# EAGLE schematic smt_xbee (EAGLE 9.6.2)

## Sheet 1 of 2
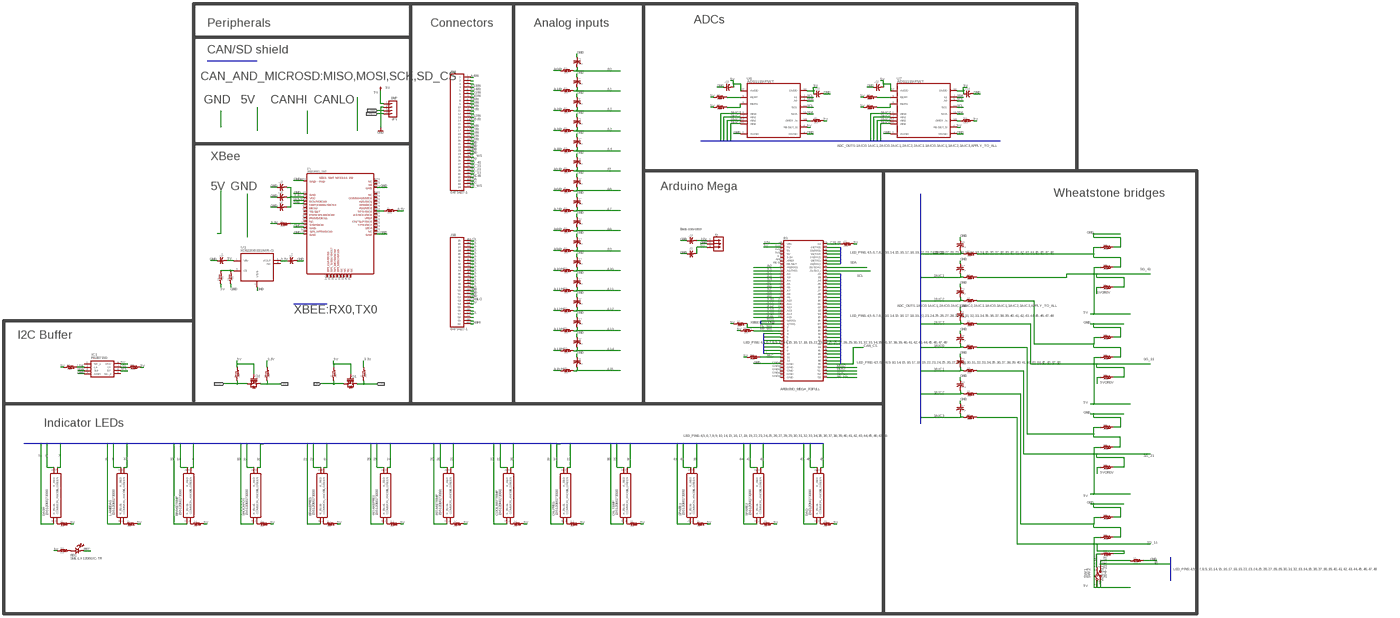
[diagram p0: schematic, sheet 1, overview]
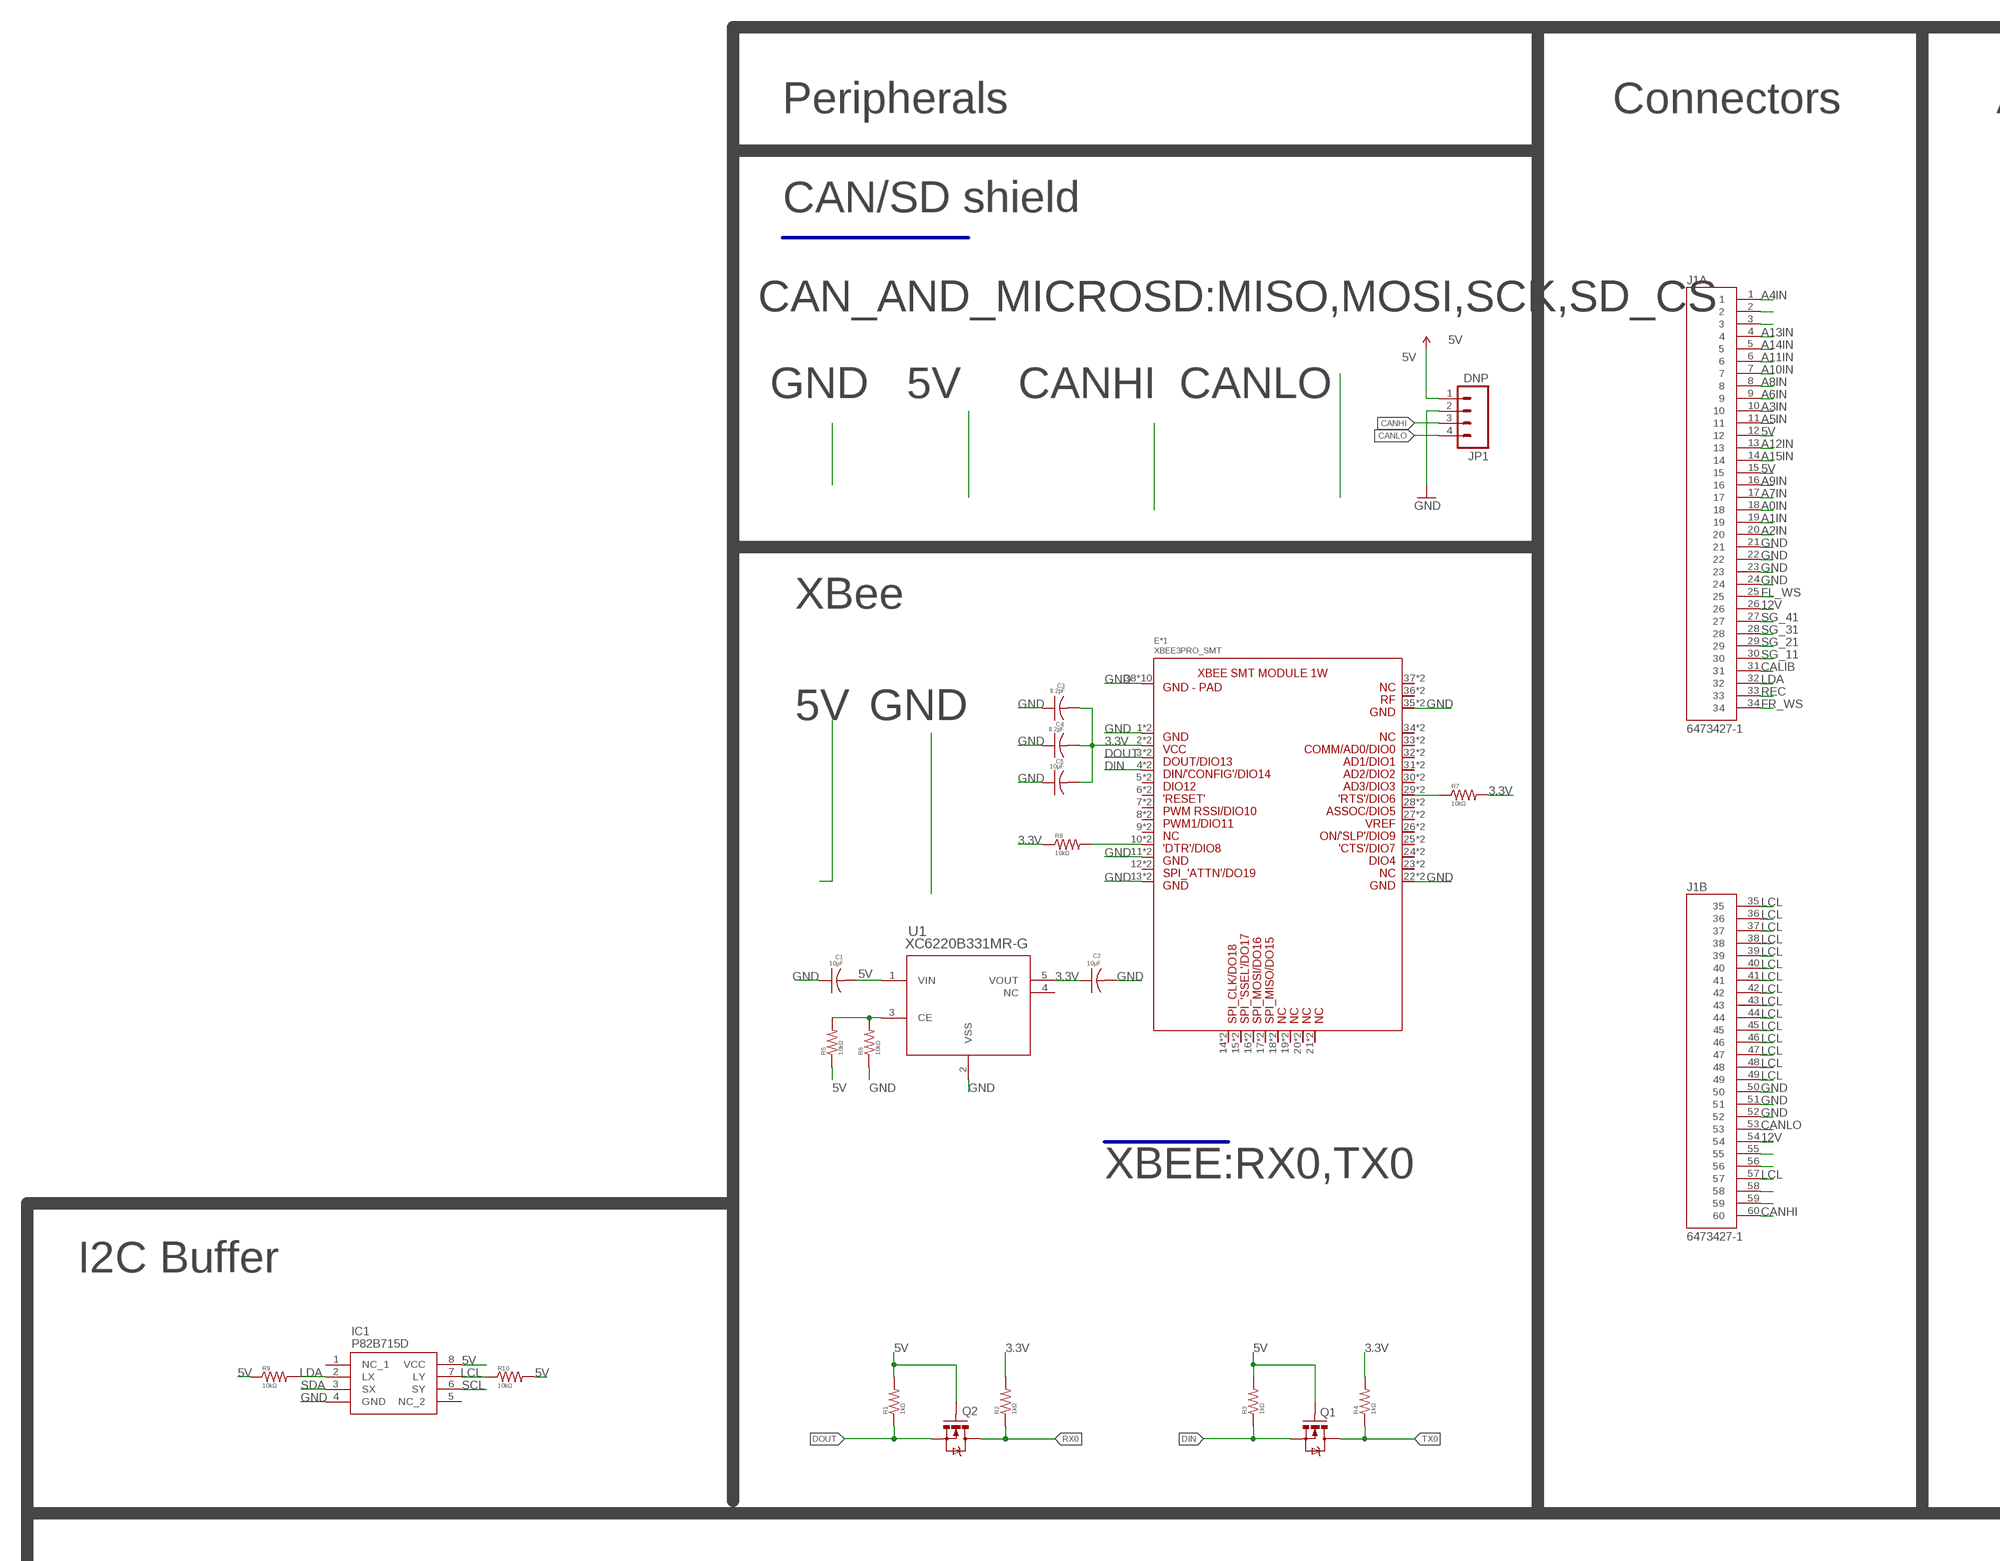
[diagram p1: schematic, sheet 1, part 1 of 5]
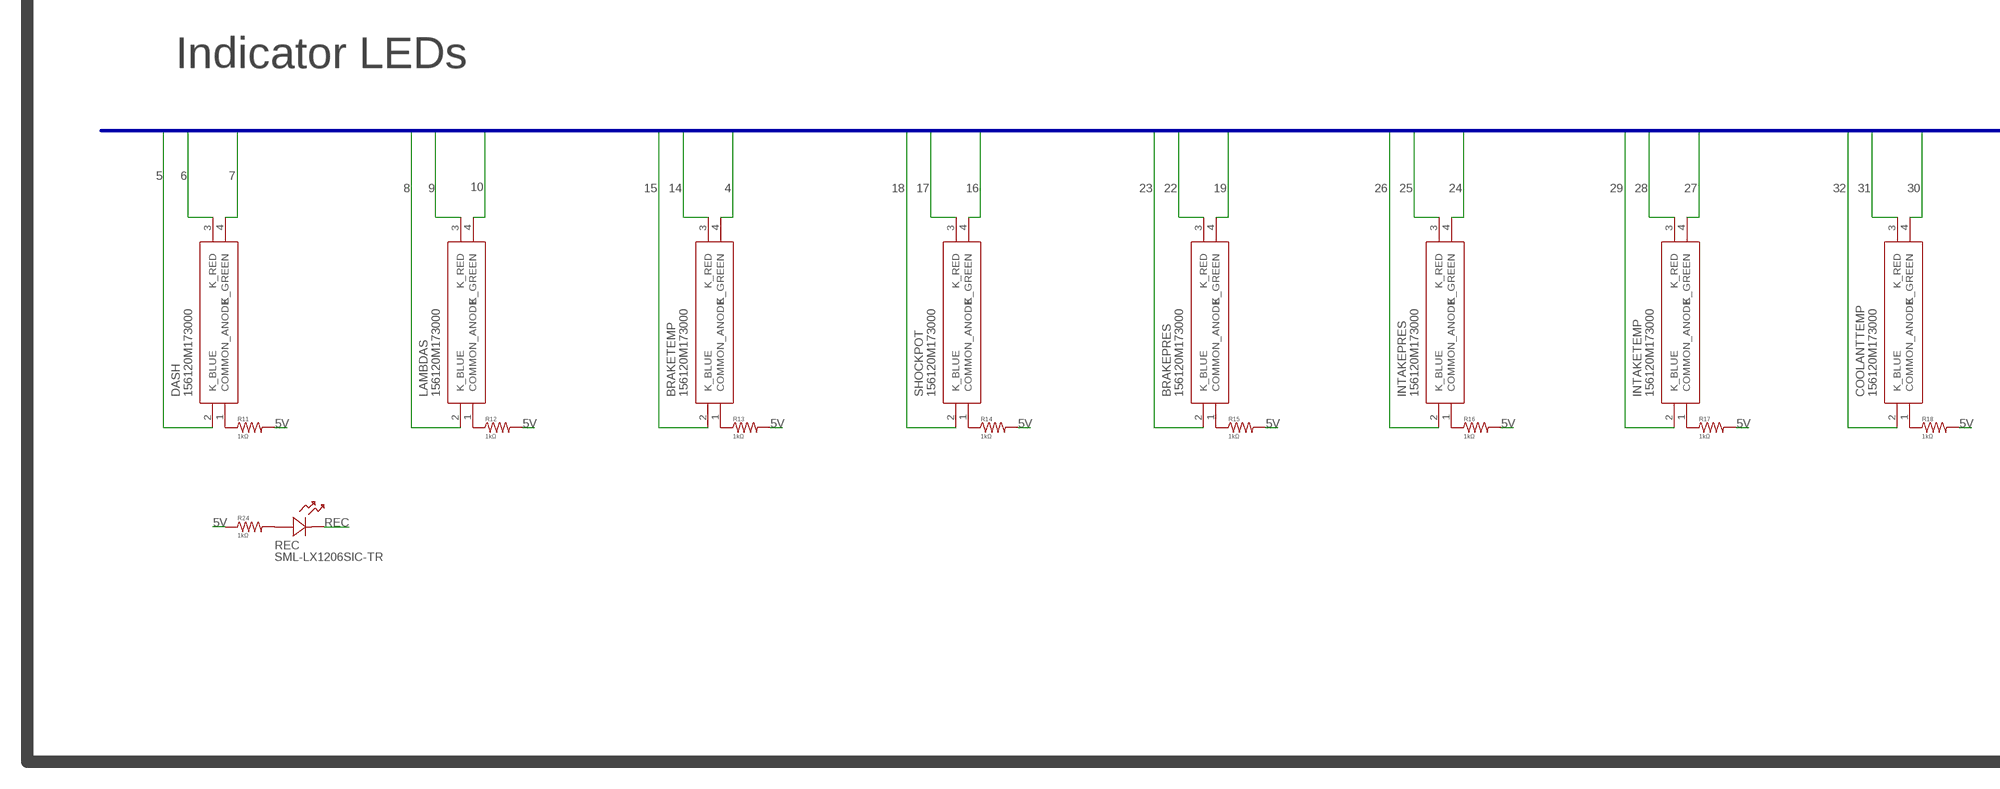
[diagram p2: schematic, sheet 1, part 2 of 5]
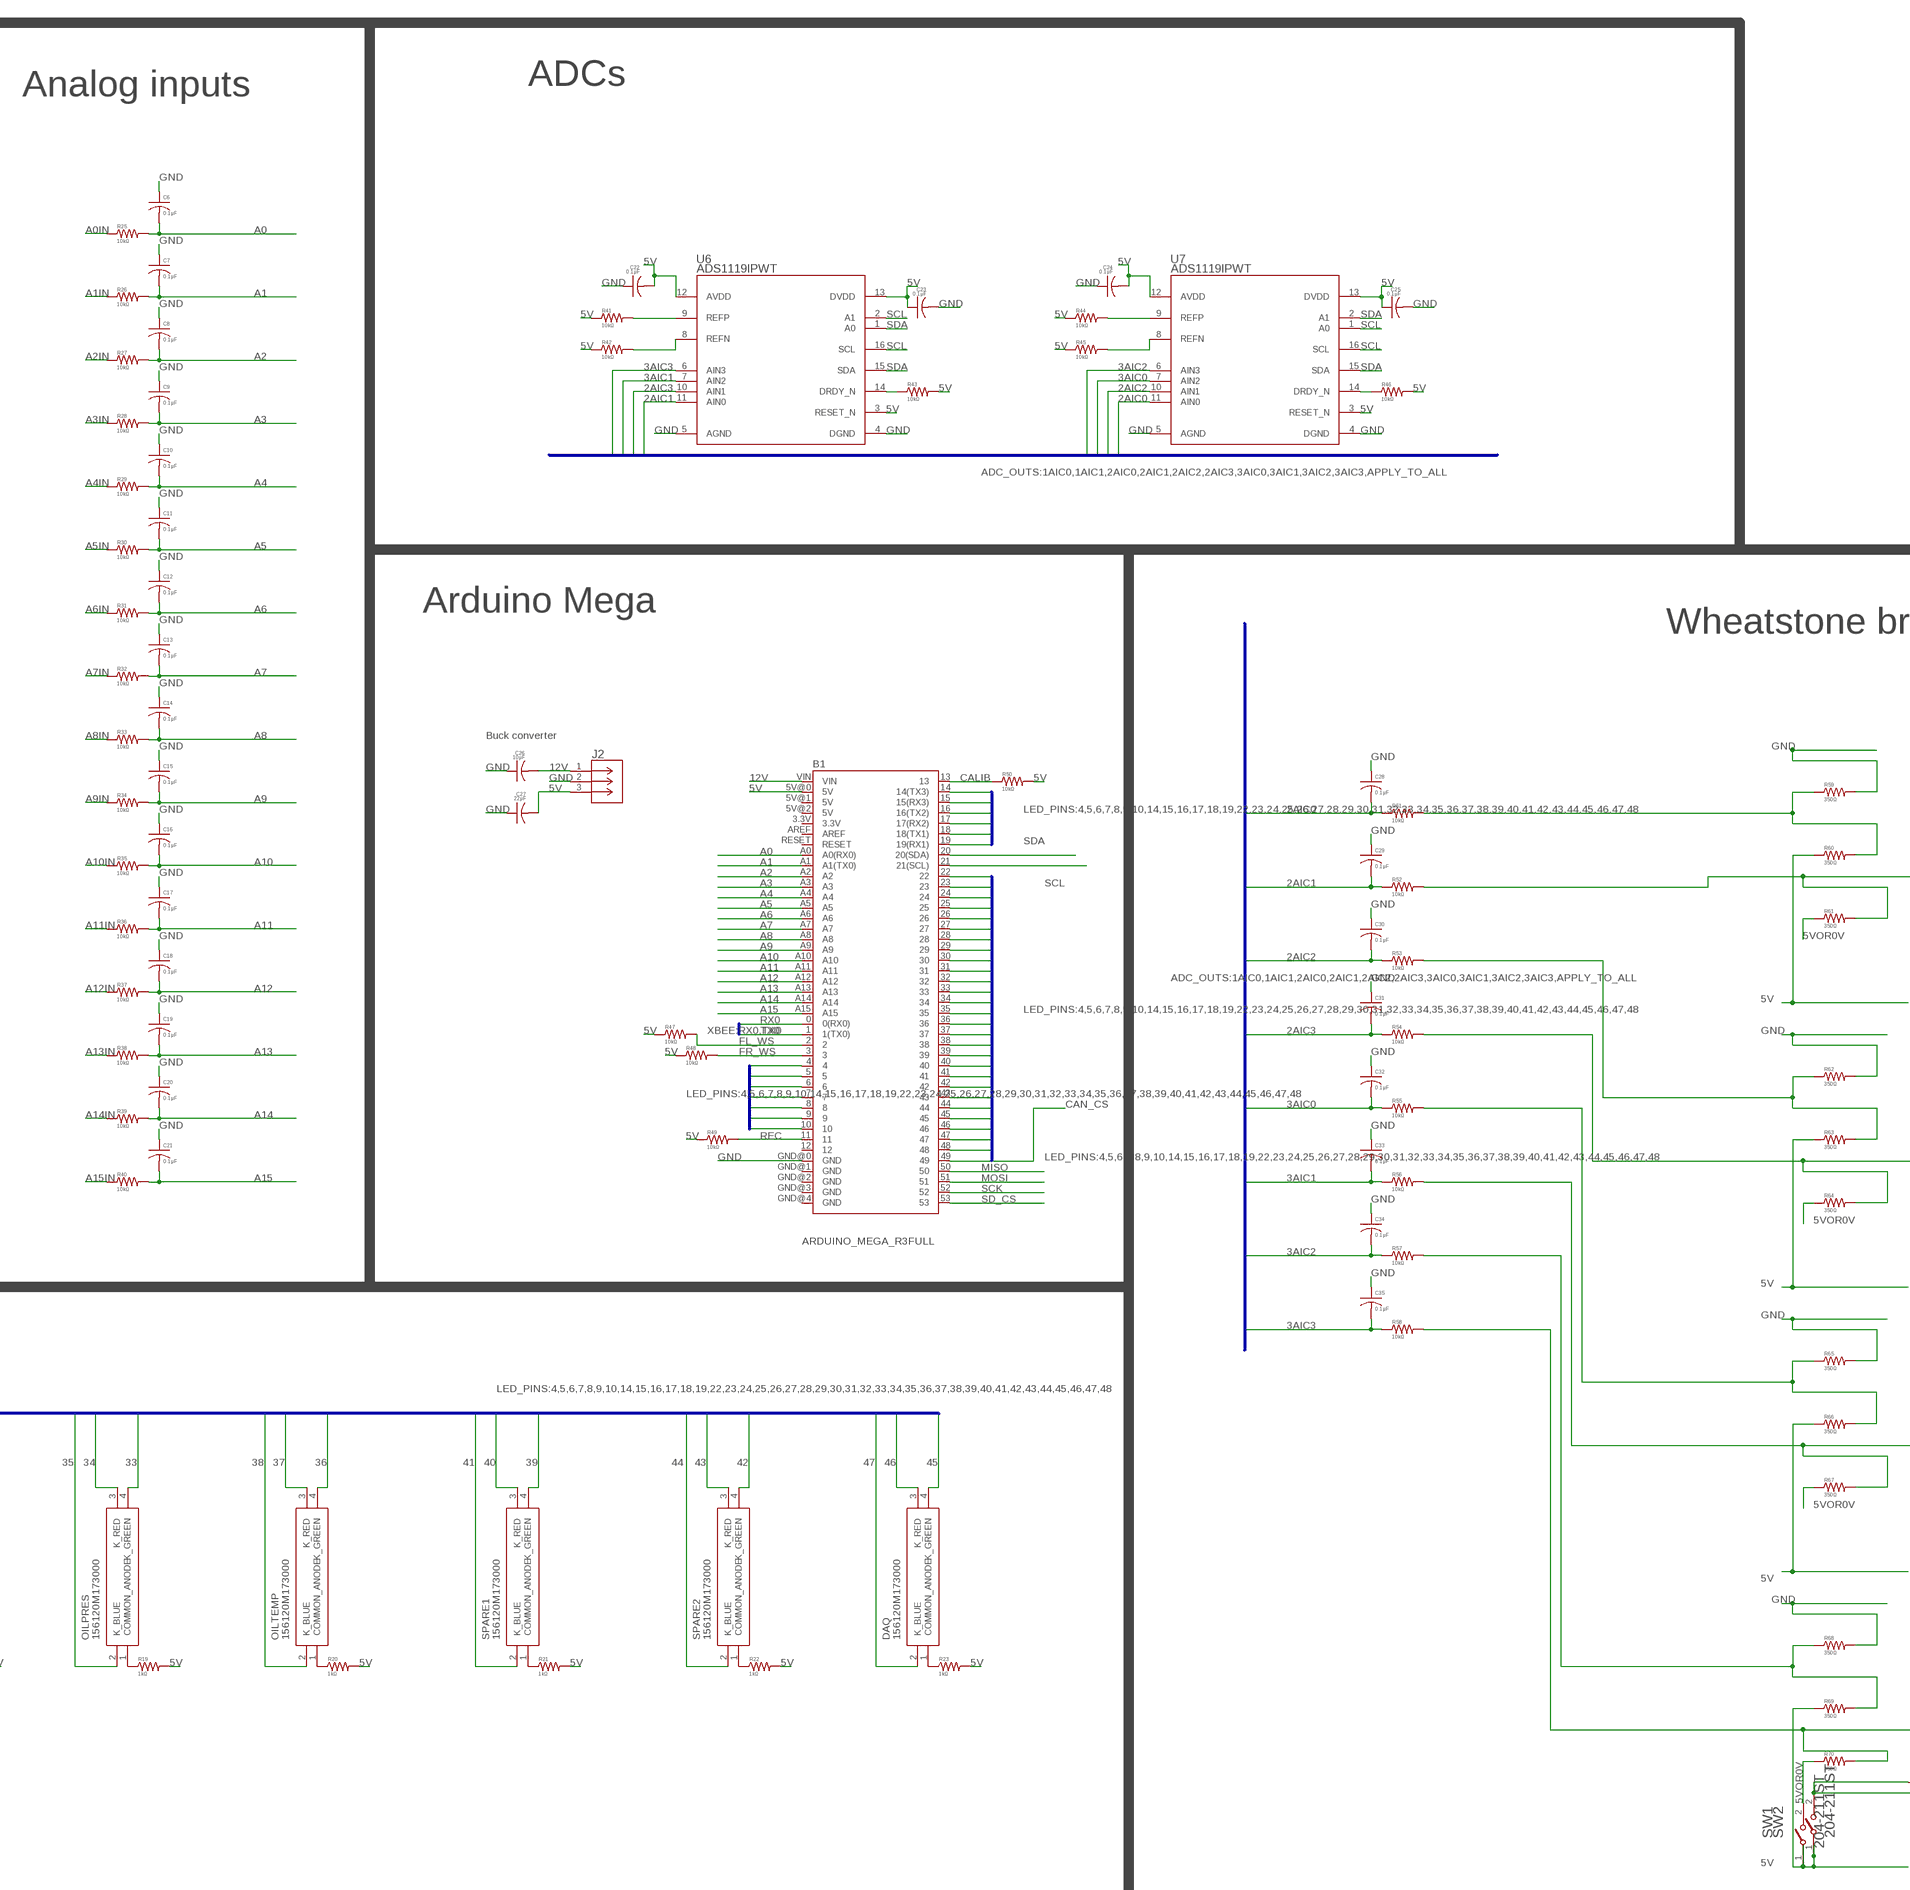
[diagram p3: schematic, sheet 1, part 3 of 5]
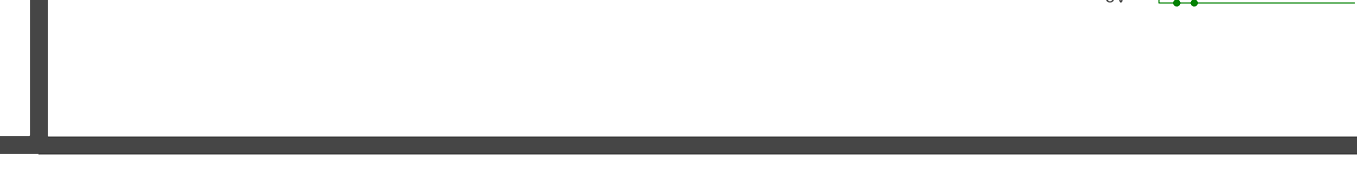
[diagram p4: schematic, sheet 1, part 4 of 5]
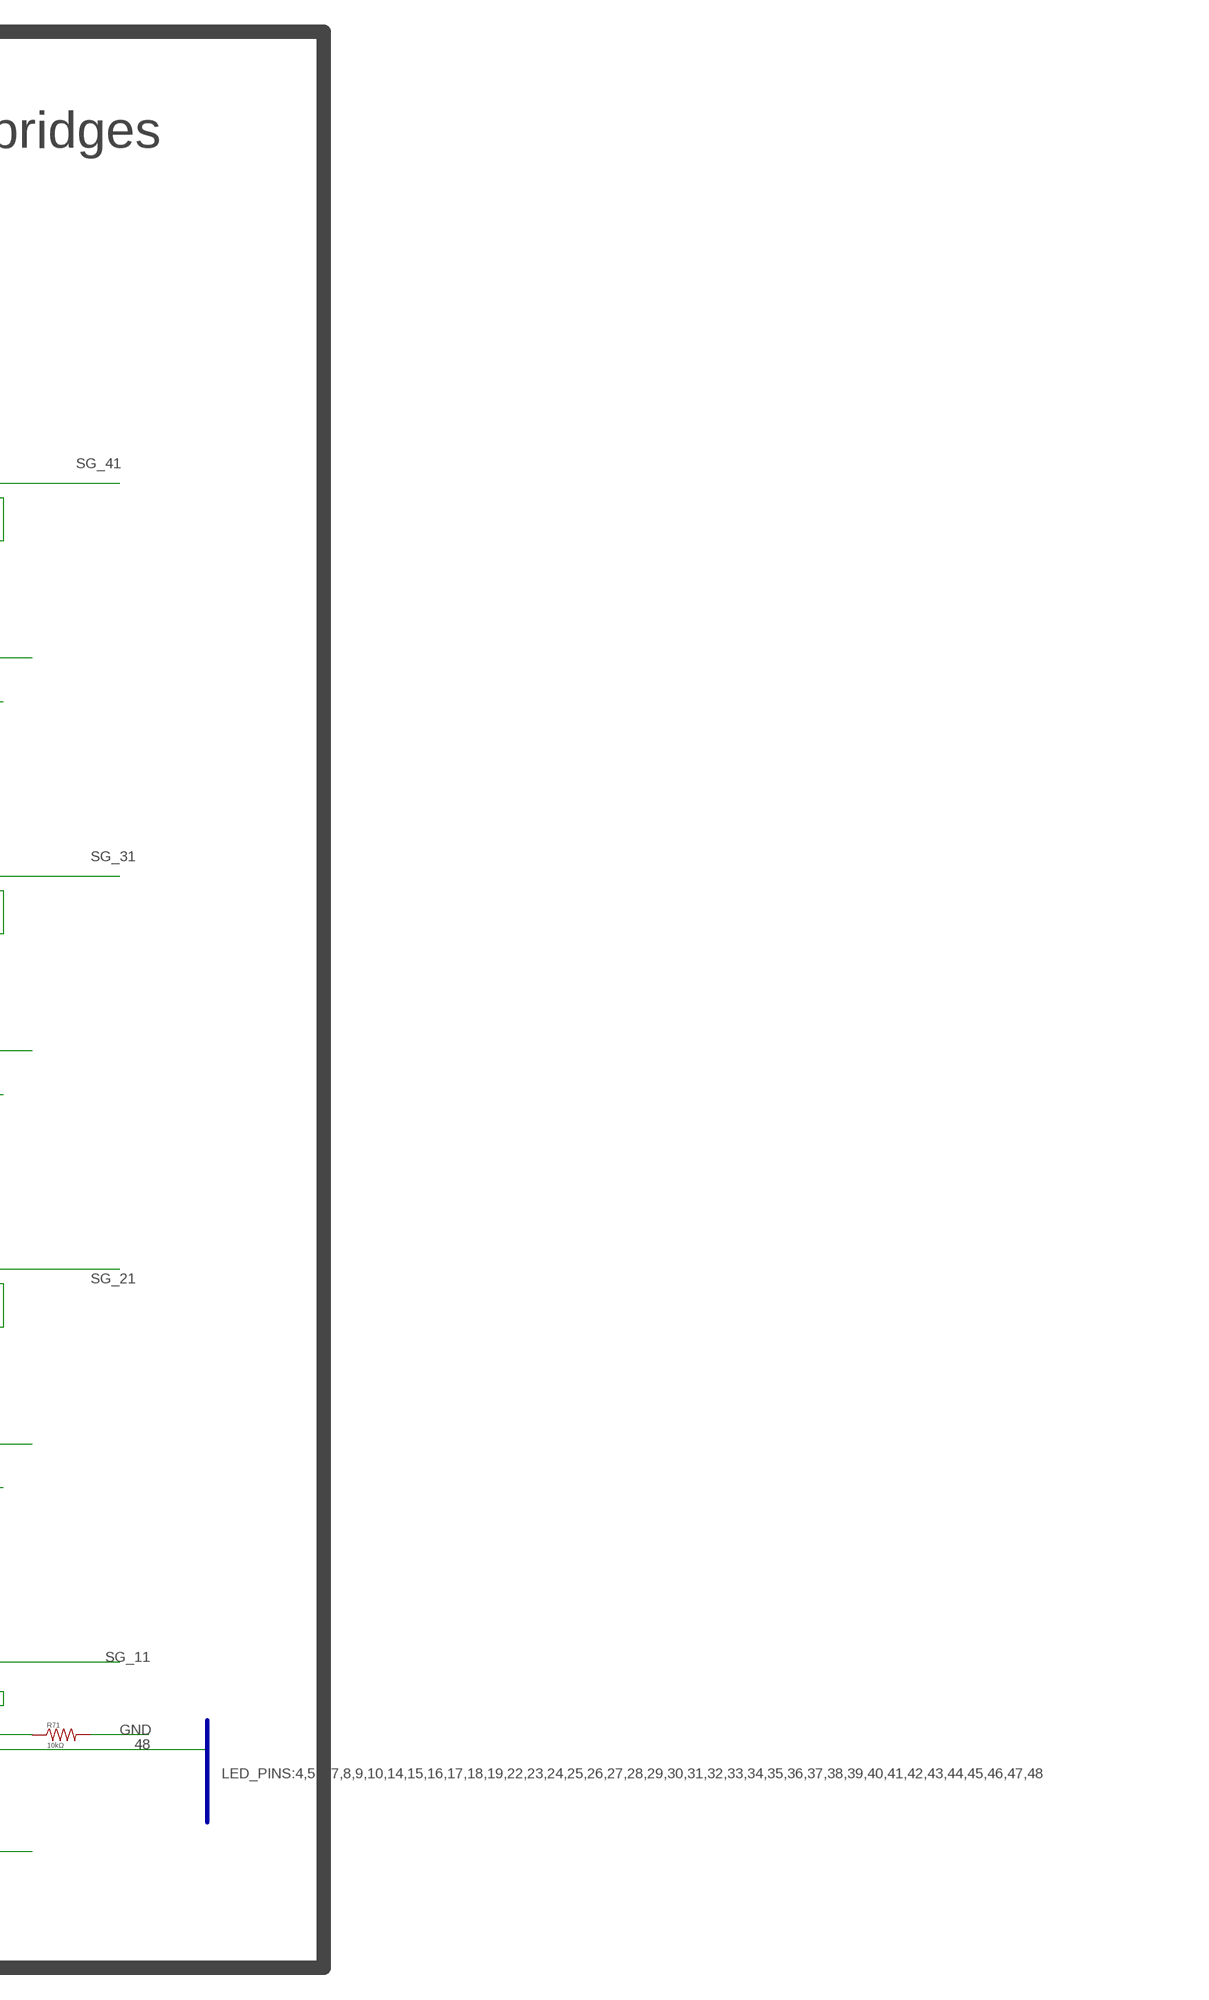
[diagram p5: schematic, sheet 1, part 5 of 5]

### Parts
B1  ARDUINO_MEGA_R3FULL  [ARDUINO_MEGA]
BRAKEPRES  156120M173000  [156120M173000]
BRAKETEMP  156120M173000  [156120M173000]
C1  10μF  C-USC1206  [C1206]
C2  10μF  C-USC1206  [C1206]
C3  8.2pF  C-USC1206  [C1206]
C4  8.2pF  C-USC1206  [C1206]
C5  10μF  C-USC1206  [C1206]
C6  0.1μF  C-USC1206  [C1206]
C7  0.1μF  C-USC1206  [C1206]
C8  0.1μF  C-USC1206  [C1206]
C9  0.1μF  C-USC1206  [C1206]
C10  0.1μF  C-USC1206  [C1206]
C11  0.1μF  C-USC1206  [C1206]
C12  0.1μF  C-USC1206  [C1206]
C13  0.1μF  C-USC1206  [C1206]
C14  0.1μF  C-USC1206  [C1206]
C15  0.1μF  C-USC1206  [C1206]
C16  0.1μF  C-USC1206  [C1206]
C17  0.1μF  C-USC1206  [C1206]
C18  0.1μF  C-USC1206  [C1206]
C19  0.1μF  C-USC1206  [C1206]
C20  0.1μF  C-USC1206  [C1206]
C21  0.1μF  C-USC1206  [C1206]
C22  0.1μF  C-USC1206  [C1206]
C23  0.1μF  C-USC1206  [C1206]
C24  0.1μF  C-USC1206  [C1206]
C25  0.1μF  C-USC1206  [C1206]
C26  10μF  C-USC1206  [C1206]
C27  22μF  C-USC1206  [C1206]
C28  0.1μF  C-USC1206  [C1206]
C29  0.1μF  C-USC1206  [C1206]
C30  0.1μF  C-USC1206  [C1206]
C31  0.1μF  C-USC1206  [C1206]
C32  0.1μF  C-USC1206  [C1206]
C33  0.1μF  C-USC1206  [C1206]
C34  0.1μF  C-USC1206  [C1206]
C35  0.1μF  C-USC1206  [C1206]
COOLANTTEMP  156120M173000  [156120M173000]
DAQ  156120M173000  [156120M173000]
DASH  156120M173000  [156120M173000]
E*1  XBEE3PRO_SMT  [XBEE3PRO_SMT_FOOTPRINT]
IC1  P82B715D  [SOIC127P600X175-8N]
INTAKEPRES  156120M173000  [156120M173000]
INTAKETEMP  156120M173000  [156120M173000]
J1  6473427-1  [TE_6473427-1]
J2  VR10S05  [CONN3_10S05_XPP]
JP1  DNP  M04PTH  [1X04]
LAMBDAS  156120M173000  [156120M173000]
OILPRES  156120M173000  [156120M173000]
OILTEMP  156120M173000  [156120M173000]
Q1  MOSFET-NCHANNELSMD  [SOT23-3]
Q2  MOSFET-NCHANNELSMD  [SOT23-3]
R1  1kΩ  R-US_R1206  [R1206]
R2  1kΩ  R-US_R1206  [R1206]
R3  1kΩ  R-US_R1206  [R1206]
R4  1kΩ  R-US_R1206  [R1206]
R5  10kΩ  R-US_R1206  [R1206]
R6  10kΩ  R-US_R1206  [R1206]
R7  10kΩ  R-US_R1206  [R1206]
R8  10kΩ  R-US_R1206  [R1206]
R9  10kΩ  R-US_R1206  [R1206]
R10  10kΩ  R-US_R1206  [R1206]
R11  1kΩ  R-US_R1206  [R1206]
R12  1kΩ  R-US_R1206  [R1206]
R13  1kΩ  R-US_R1206  [R1206]
R14  1kΩ  R-US_R1206  [R1206]
R15  1kΩ  R-US_R1206  [R1206]
R16  1kΩ  R-US_R1206  [R1206]
R17  1kΩ  R-US_R1206  [R1206]
R18  1kΩ  R-US_R1206  [R1206]
R19  1kΩ  R-US_R1206  [R1206]
R20  1kΩ  R-US_R1206  [R1206]
R21  1kΩ  R-US_R1206  [R1206]
R22  1kΩ  R-US_R1206  [R1206]
R23  1kΩ  R-US_R1206  [R1206]
R24  1kΩ  R-US_R1206  [R1206]
R25  10kΩ  R-US_R1206  [R1206]
R26  10kΩ  R-US_R1206  [R1206]
R27  10kΩ  R-US_R1206  [R1206]
R28  10kΩ  R-US_R1206  [R1206]
R29  10kΩ  R-US_R1206  [R1206]
R30  10kΩ  R-US_R1206  [R1206]
R31  10kΩ  R-US_R1206  [R1206]
R32  10kΩ  R-US_R1206  [R1206]
R33  10kΩ  R-US_R1206  [R1206]
R34  10kΩ  R-US_R1206  [R1206]
R35  10kΩ  R-US_R1206  [R1206]
R36  10kΩ  R-US_R1206  [R1206]
R37  10kΩ  R-US_R1206  [R1206]
R38  10kΩ  R-US_R1206  [R1206]
R39  10kΩ  R-US_R1206  [R1206]
R40  10kΩ  R-US_R1206  [R1206]
R41  10kΩ  R-US_R1206  [R1206]
R42  10kΩ  R-US_R1206  [R1206]
R43  10kΩ  R-US_R1206  [R1206]
R44  10kΩ  R-US_R1206  [R1206]
R45  10kΩ  R-US_R1206  [R1206]
R46  10kΩ  R-US_R1206  [R1206]
R47  10kΩ  R-US_R1206  [R1206]
R48  10kΩ  R-US_R1206  [R1206]
R49  10kΩ  R-US_R1206  [R1206]
R50  10kΩ  R-US_R1206  [R1206]
R51  10kΩ  R-US_R1206  [R1206]
R52  10kΩ  R-US_R1206  [R1206]
R53  10kΩ  R-US_R1206  [R1206]
R54  10kΩ  R-US_R1206  [R1206]
R55  10kΩ  R-US_R1206  [R1206]
R56  10kΩ  R-US_R1206  [R1206]
R57  10kΩ  R-US_R1206  [R1206]
R58  10kΩ  R-US_R1206  [R1206]
R59  350Ω  R-US_R1206  [R1206]
R60  350Ω  R-US_R1206  [R1206]
R61  350Ω  R-US_R1206  [R1206]
R62  350Ω  R-US_R1206  [R1206]
R63  350Ω  R-US_R1206  [R1206]
R64  350Ω  R-US_R1206  [R1206]
R65  350Ω  R-US_R1206  [R1206]
R66  350Ω  R-US_R1206  [R1206]
R67  350Ω  R-US_R1206  [R1206]
R68  350Ω  R-US_R1206  [R1206]
R69  350Ω  R-US_R1206  [R1206]
R70  350Ω  R-US_R1206  [R1206]
R71  10kΩ  R-US_R1206  [R1206]
REC  SML-LX1206SIC-TR  [LED_SML-LX1206SIC-TR_LUM]
SHOCKPOT  156120M173000  [156120M173000]
SPARE1  156120M173000  [156120M173000]
SPARE2  156120M173000  [156120M173000]
SW1  CTS_ELECTROCOMPONENTS_204-211STCTS_ELECTROCOMPONENTS_204-211ST_0_0  [CTS_ELECTROCOMPONENTS_204-211ST_0]
SW2  CTS_ELECTROCOMPONENTS_204-211STCTS_ELECTROCOMPONENTS_204-211ST_0_0  [CTS_ELECTROCOMPONENTS_204-211ST_0]
U1  XC6220B331MR-G  [SOT-25_TOR]
U6  ADS1119IPWT  [PW0016A_N]
U7  ADS1119IPWT  [PW0016A_N]

### Nets
2AIC0: C28.2 R51.1 U7.11(AIN0)
2AIC1: C29.2 R52.1 U6.11(AIN0)
2AIC2: C30.2 R53.1 U7.10(AIN1)
2AIC3: C31.2 R54.1 U6.10(AIN1)
3.3V: C2.1 C3.2 C4.2 C5.2 E*1.2 E*1.2-1 R2.2 R4.2 R7.2 R8.1 U1.5(VOUT) ; also sheet 2
3AIC0: C32.2 R55.1 U7.7(AIN2)
3AIC1: C33.2 R56.1 U6.7(AIN2)
3AIC2: C34.2 R57.1 U7.6(AIN3)
3AIC3: C35.2 R58.1 U6.6(AIN3)
4: B1.4 BRAKETEMP.4(K_GREEN)
5: B1.5 DASH.2(K_BLUE)
5V: B1.5V@0(5V) C1.2 C22.2 C23.1 C24.2 C25.1 C27.2 IC1.8(VCC) J1.12 J1.15 J2.3 JP1.1 Q1.1(G) Q2.1(G) R1.2 R3.2 R5.1 R9.1 R10.2 R11.2 R12.2 R13.2 R14.2 R15.2 R16.2 R17.2 R18.2 R19.2 R20.2 R21.2 R22.2 R23.2 R24.1 R41.1 R42.1 R43.2 R44.1 R45.1 R46.2 R47.1 R48.1 R49.1 R50.2 R60.1 R63.1 R66.1 R69.1 SW1.1 SW2.1 U1.1(VIN) U6.3(RESET_N) U6.12(AVDD) U6.13(DVDD) U7.3(RESET_N) U7.12(AVDD) U7.13(DVDD) ; also sheet 2
5VOR0V: R61.1 R64.1 R67.1 R70.1 SW1.2
6: B1.6 DASH.3(K_RED)
7: B1.7 DASH.4(K_GREEN)
8: B1.8 LAMBDAS.2(K_BLUE)
9: B1.9 LAMBDAS.3(K_RED)
10: B1.10 LAMBDAS.4(K_GREEN)
12V: B1.VIN C26.2 J1.26 J1.54 J2.1
14: B1.14(14(TX3)) BRAKETEMP.3(K_RED)
15: B1.15(15(RX3)) BRAKETEMP.2(K_BLUE)
16: B1.16(16(TX2)) SHOCKPOT.4(K_GREEN)
17: B1.17(17(RX2)) SHOCKPOT.3(K_RED)
18: B1.18(18(TX1)) SHOCKPOT.2(K_BLUE)
19: B1.19(19(RX1)) BRAKEPRES.4(K_GREEN)
22: B1.22 BRAKEPRES.3(K_RED)
23: B1.23 BRAKEPRES.2(K_BLUE)
24: B1.24 INTAKEPRES.4(K_GREEN)
25: B1.25 INTAKEPRES.3(K_RED)
26: B1.26 INTAKEPRES.2(K_BLUE)
27: B1.27 INTAKETEMP.4(K_GREEN)
28: B1.28 INTAKETEMP.3(K_RED)
29: B1.29 INTAKETEMP.2(K_BLUE)
30: B1.30 COOLANTTEMP.4(K_GREEN)
31: B1.31 COOLANTTEMP.3(K_RED)
32: B1.32 COOLANTTEMP.2(K_BLUE)
33: B1.33 OILPRES.4(K_GREEN)
34: B1.34 OILPRES.3(K_RED)
35: B1.35 OILPRES.2(K_BLUE)
36: B1.36 OILTEMP.4(K_GREEN)
37: B1.37 OILTEMP.3(K_RED)
38: B1.38 OILTEMP.2(K_BLUE)
39: B1.39 SPARE1.4(K_GREEN)
40: B1.40 SPARE1.3(K_RED)
41: B1.41 SPARE1.2(K_BLUE)
42: B1.42 SPARE2.4(K_GREEN)
43: B1.43 SPARE2.3(K_RED)
44: B1.44 SPARE2.2(K_BLUE)
45: B1.45 DAQ.4(K_GREEN)
46: B1.46 DAQ.3(K_RED)
47: B1.47 DAQ.2(K_BLUE)
48: B1.48 R71.1 SW2.2
A0: B1.A0(A0(RX0)) C6.2 R25.2
A0IN: J1.18 R25.1
A1: B1.A1(A1(TX0)) C7.2 R26.2
A1IN: J1.19 R26.1
A2: B1.A2 C8.2 R27.2
A2IN: J1.20 R27.1
A3: B1.A3 C9.2 R28.2
A3IN: J1.10 R28.1
A4: B1.A4 C10.2 R29.2
A4IN: J1.1 R29.1
A5: B1.A5 C11.2 R30.2
A5IN: J1.11 R30.1
A6: B1.A6 C12.2 R31.2
A6IN: J1.9 R31.1
A7: B1.A7 C13.2 R32.2
A7IN: J1.17 R32.1
A8: B1.A8 C14.2 R33.2
A8IN: J1.8 R33.1
A9: B1.A9 C15.2 R34.2
A9IN: J1.16 R34.1
A10: B1.A10 C16.2 R35.2
A10IN: J1.7 R35.1
A11: B1.A11 C17.2 R36.2
A11IN: J1.6 R36.1
A12: B1.A12 C18.2 R37.2
A12IN: J1.13 R37.1
A13: B1.A13 C19.2 R38.2
A13IN: J1.4 R38.1
A14: B1.A14 C20.2 R39.2
A14IN: J1.5 R39.1
A15: B1.A15 C21.2 R40.2
A15IN: J1.14 R40.1
CALIB: B1.13 J1.31 R50.1
CAN_CS: B1.49 ; also sheet 2
CANHI: J1.60 JP1.3
CANLO: J1.53 JP1.4
DIN: E*1.4 E*1.4-1 Q1.2(S) R3.1
DOUT: E*1.3 E*1.3-1 Q2.2(S) R1.1
FL_WS: B1.2 J1.25 R47.2
FR_WS: B1.3 J1.34 R48.2
GND: B1.GND@0(GND) C1.1 C2.2 C3.1 C4.1 C5.1 C6.1 C7.1 C8.1 C9.1 C10.1 C11.1 C12.1 C13.1 C14.1 C15.1 C16.1 C17.1 C18.1 C19.1 C20.1 C21.1 C22.1 C23.2 C24.1 C25.2 C26.1 C27.1 C28.1 C29.1 C30.1 C31.1 C32.1 C33.1 C34.1 C35.1 E*1.1 E*1.1-1 E*1.11 E*1.11-1 E*1.13 E*1.13-1 E*1.22 E*1.22-1 E*1.35 E*1.35-1 E*1.38 E*1.38-1 E*1.38-2 E*1.38-3 E*1.38-4 E*1.38-5 E*1.38-6 E*1.38-7 E*1.38-8 E*1.38-9 IC1.4(GND) J1.21 J1.22 J1.23 J1.24 J1.50 J1.51 J1.52 J2.2 JP1.2 R6.1 R59.2 R62.2 R65.2 R68.2 R71.2 U1.2(VSS) U6.4(DGND) U6.5(AGND) U7.4(DGND) U7.5(AGND) ; also sheet 2
LCL: IC1.7(LY) J1.35 J1.36 J1.37 J1.38 J1.39 J1.40 J1.41 J1.42 J1.43 J1.44 J1.45 J1.46 J1.47 J1.48 J1.49 J1.57 R10.1
LDA: IC1.2(LX) J1.32 R9.2
MISO: B1.50 ; also sheet 2
MOSI: B1.51 ; also sheet 2
N$1: INTAKEPRES.1(COMMON_ANODE) R16.1
N$2: R5.2 R6.2 U1.3(CE)
N$4: DASH.1(COMMON_ANODE) R11.1
N$5: INTAKETEMP.1(COMMON_ANODE) R17.1
N$6: COOLANTTEMP.1(COMMON_ANODE) R18.1
N$7: OILPRES.1(COMMON_ANODE) R19.1
N$8: OILTEMP.1(COMMON_ANODE) R20.1
N$9: R21.1 SPARE1.1(COMMON_ANODE)
N$10: R22.1 SPARE2.1(COMMON_ANODE)
N$11: DAQ.1(COMMON_ANODE) R23.1
N$12: R24.2 REC.2
N$13: E*1.10 E*1.10-1 R8.2
N$14: J1.58
N$15: R43.1 U6.14(DRDY_N)
N$17: LAMBDAS.1(COMMON_ANODE) R12.1
N$18: BRAKETEMP.1(COMMON_ANODE) R13.1
N$19: R14.1 SHOCKPOT.1(COMMON_ANODE)
N$20: BRAKEPRES.1(COMMON_ANODE) R15.1
N$21: E*1.29 E*1.29-1 R7.1
N$24: R51.2 R59.1 R60.2
N$32: R53.2 R62.1 R63.2
N$35: R46.1 U7.14(DRDY_N)
N$36: J1.55
N$37: J1.56
N$38: J1.59
N$39: J1.2
N$40: R55.2 R65.1 R66.2
N$41: J1.3
N$42: R41.2 U6.9(REFP)
N$43: R42.2 U6.8(REFN)
N$44: R44.2 U7.9(REFP)
N$45: R45.2 U7.8(REFN)
N$47: R57.2 R68.1 R69.2
REC: B1.11 J1.33 R49.2 REC.1
RX0: B1.0(0(RX0)) Q2.3(D) R2.1
SCK: B1.52 ; also sheet 2
SCL: B1.21(21(SCL)) IC1.6(SY) U6.2(A1) U6.16(SCL) U7.1(A0) U7.16(SCL)
SD_CS: B1.53 ; also sheet 2
SDA: B1.20(20(SDA)) IC1.3(SX) U6.1(A0) U6.15(SDA) U7.2(A1) U7.15(SDA)
SG_11: J1.30 R58.2 R70.2
SG_21: J1.29 R56.2 R67.2
SG_31: J1.28 R54.2 R64.2
SG_41: J1.27 R52.2 R61.2
TX0: B1.1(1(TX0)) Q1.3(D) R4.1
Unconnected: B1.3.3V B1.5V@1(5V) B1.5V@2(5V) B1.12 B1.AREF B1.GND@1(GND) B1.GND@2(GND) B1.GND@3(GND) B1.GND@4(GND) B1.RESET E*1.5 E*1.5-1 E*1.6 E*1.6-1 E*1.7 E*1.7-1 E*1.8 E*1.8-1 E*1.9 E*1.9-1 E*1.12 E*1.12-1 E*1.14 E*1.14-1 E*1.15 E*1.15-1 E*1.16 E*1.16-1 E*1.17 E*1.17-1 E*1.18 E*1.18-1 E*1.19 E*1.19-1 E*1.20 E*1.20-1 E*1.21 E*1.21-1 E*1.23 E*1.23-1 E*1.24 E*1.24-1 E*1.25 E*1.25-1 E*1.26 E*1.26-1 E*1.27 E*1.27-1 E*1.28 E*1.28-1 E*1.30 E*1.30-1 E*1.31 E*1.31-1 E*1.32 E*1.32-1 E*1.33 E*1.33-1 E*1.34 E*1.34-1 E*1.36 E*1.36-1 E*1.37 E*1.37-1 IC1.1(NC_1) IC1.5(NC_2) U1.4(NC)

### Buses
ADC_OUTS:1AIC0,1AIC1,2AIC0,2AIC1,2AIC2,2AIC3,3AIC0,3AIC1,3AIC2,3AIC3,APPLY_TO_ALL
CAN_AND_MICROSD:MISO,MOSI,SCK,SD_CS
XBEE:RX0,TX0
LED_PINS:4,5,6,7,8,9,10,14,15,16,17,18,19,22,23,24,25,26,27,28,29,30,31,32,33,34,35,36,37,38,39,40,41,42,43,44,45,46,47,48

### Notes on the sheet
- Peripherals | Connectors | Analog inputs | ADCs
- CAN/SD shield
- XBee
- Arduino Mega
- Wheatstone bridges
- Buck converter
- I2C Buffer
- Indicator LEDs

## Sheet 2 of 2
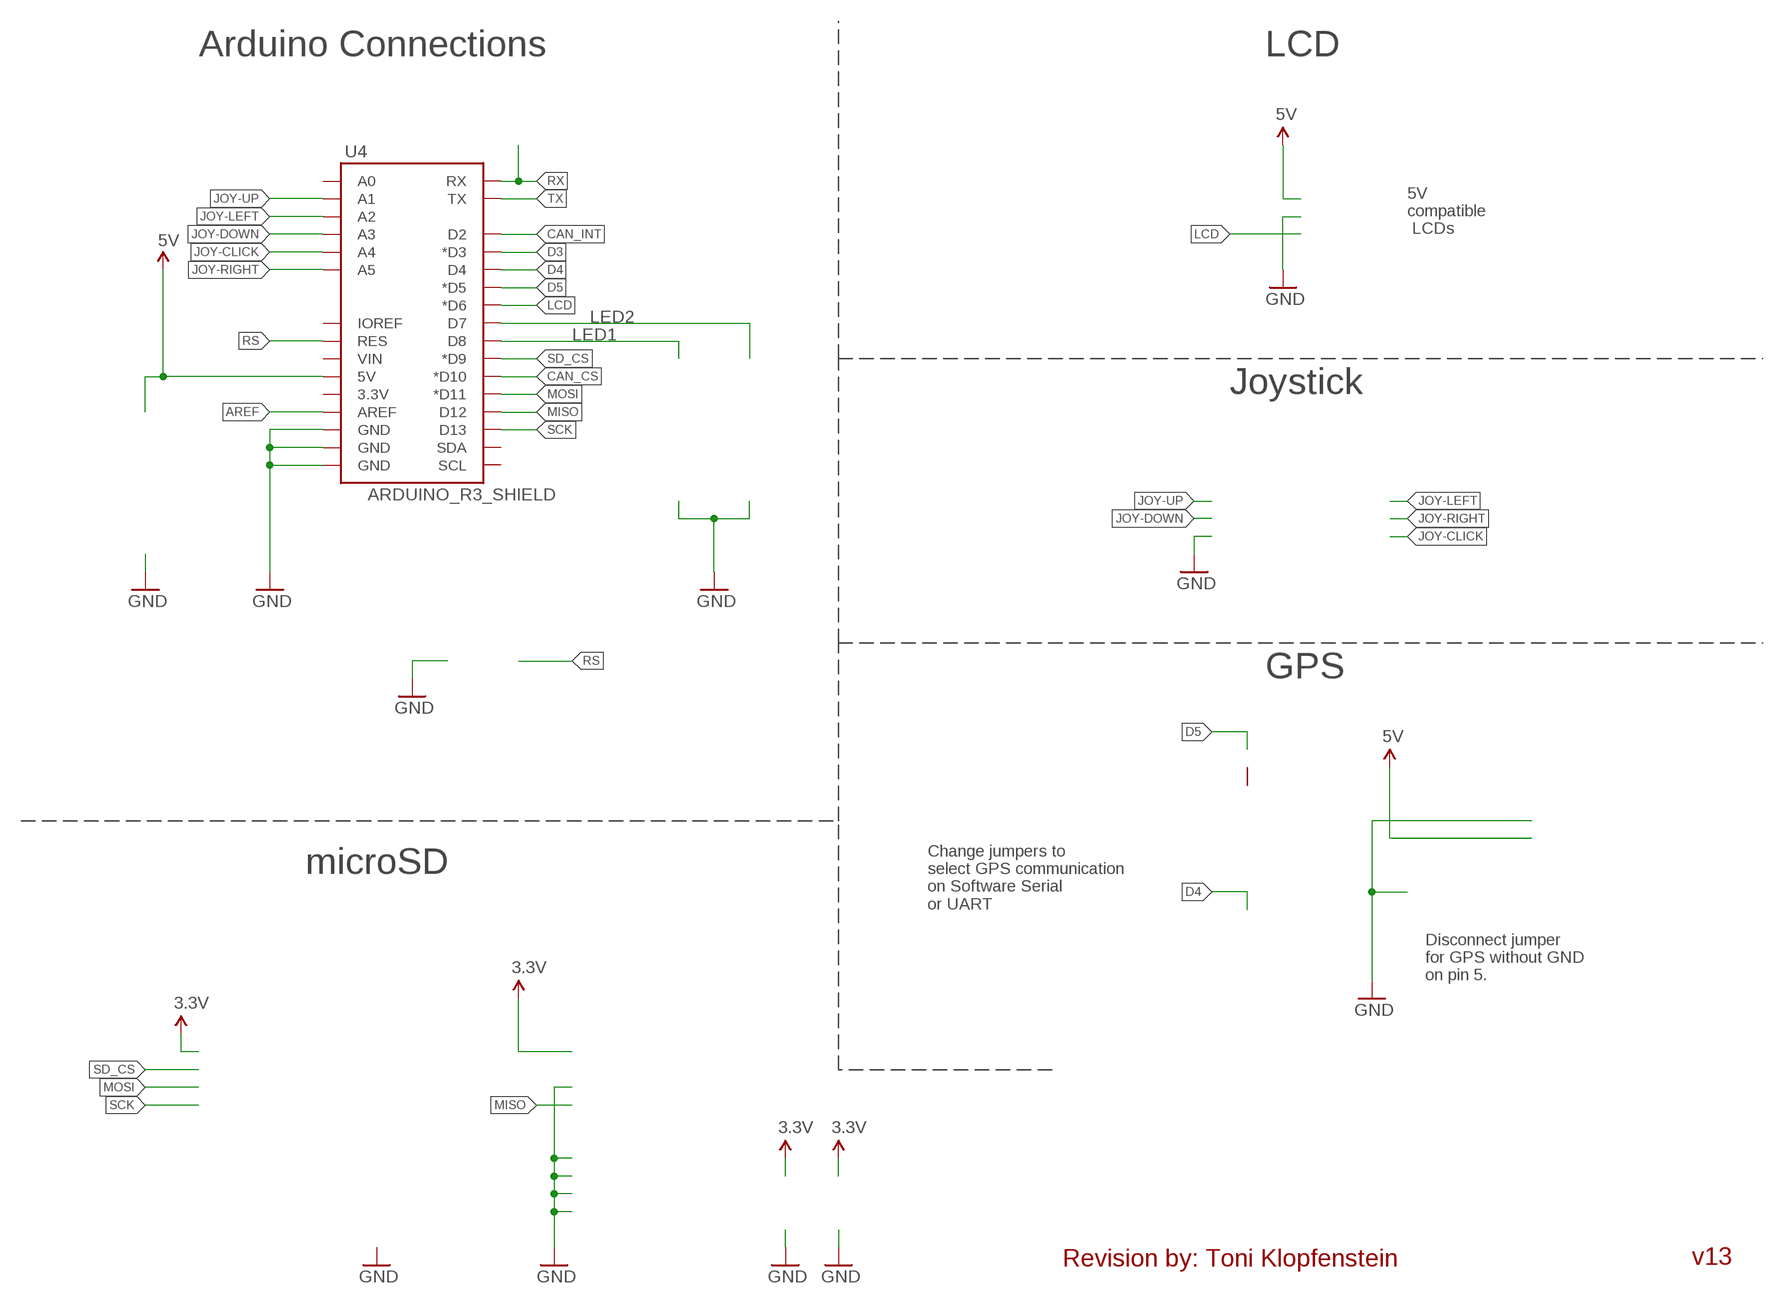
[diagram p6: schematic, sheet 2]

### Parts
U4  ARDUINO_R3_SHIELD  [UNO_R3_SHIELD]

### Nets
5V: U4.5V ; also sheet 1
AREF: U4.AREF
CAN_CS: U4.D10(*D10) ; also sheet 1
CAN_INT: U4.D2
D3: U4.D3(*D3)
D4: U4.D4
D5: U4.D5(*D5)
GND: U4.GND@0(GND) U4.GND@1(GND) U4.GND@2(GND) ; also sheet 1
JOY-CLICK: U4.A4
JOY-DOWN: U4.A3
JOY-LEFT: U4.A2
JOY-RIGHT: U4.A5
JOY-UP: U4.A1
LCD: U4.D6(*D6)
LED1: U4.D8
LED2: U4.D7
MISO: U4.D12 ; also sheet 1
MOSI: U4.D11(*D11) ; also sheet 1
RS: U4.RES
RX: U4.RX
SCK: U4.D13 ; also sheet 1
SD_CS: U4.D9(*D9) ; also sheet 1
TX: U4.TX
Unconnected: U4.3.3V U4.A0 U4.IOREF U4.SCL U4.SDA U4.VIN

### Notes on the sheet
- Arduino Connections | LCD
- 5V 
  compatible
   LCDs
- Joystick
- GPS
- microSD
- Change jumpers to 
  select GPS communication
  on Software Serial 
  or UART
- Disconnect jumper
  for GPS without GND
  on pin 5.
- Revision by: Toni Klopfenstein | v13

## Library data of the parts
B1 = SparkFun-Boards:ARDUINO_MEGA_R3: Arduino Mega R3 ATmega2560 R3 compatible footprint. SparkFun Products: Arduino Mega 2560 R3 <https://www.sparkfun.com/products/11061>
BRAKEPRES BRAKETEMP COOLANTTEMP DAQ DASH INTAKEPRES INTAKETEMP LAMBDAS OILPRES OILTEMP SHOCKPOT SPARE1 SPARE2 = SamacSys_Parts:156120M173000: 2.4 V, 3.6 V RGB LED 3216 (1206) SMD, Wurth Elektronik WL-SFRW 156120M173000 Source: Datasheet <https://katalog.we-online.de/led/datasheet/156120M173000.pdf>; DESCRIPTION: 2.4 V, 3.6 V RGB LED 3216 (1206) SMD, Wurth Elektronik WL-SFRW 156120M173000; HEIGHT: 1.25mm; MANUFACTURER_NAME: Wurth Elektronik; MANUFACTURER_PART_NUMBER: 156120M173000; MOUSER_PART_NUMBER: 710-156120M173000; MOUSER_PRICE-STOCK: https://www.mouser.co.uk/ProductDetail/Wurth-Elektronik/156120M173000?qs=u16ybLDytRY9pBY8Z%2Fs7dQ%3D%3D
C1-C35 = 1206cap:C-US
E*1 = xbee3pro_smt:XBEE3PRO_SMT: XBEE SMT MODULE 1W
IC1 = SamacSys_Parts:P82B715D: Texas Instruments P82B715D, Dual, Bus Buffer, 4.5 12 V, 8-Pin SOIC Source: Datasheet <http://componentsearchengine.com/Datasheets/3/P82B715D.pdf>; DESCRIPTION: Texas Instruments P82B715D, Dual, Bus Buffer, 4.5 12 V, 8-Pin SOIC; HEIGHT: 1.75mm; MANUFACTURER_NAME: Texas Instruments; MANUFACTURER_PART_NUMBER: P82B715D; MOUSER_PART_NUMBER: 595-P82B715D; MOUSER_PRICE-STOCK: https://www.mouser.co.uk/ProductDetail/Texas-Instruments/P82B715D?qs=ToK3%2FczOkx%2Fmhyx%252Bp5%2FQZw%3D%3D
J1 = 6473427-1:6473427-1: CONN RECPT 60POS R/A 3MM AU Check prices <https://pricing.snapeda.com/parts/6473427-1/TE%20Connectivity/view-part?ref=eda>; AVAILABILITY: In Stock; COMMENT: 6473427-1; DESCRIPTION: Conn Wire to Board PIN 3mm Solder RA Thru-Hole; EU_ROHS_COMPLIANCE: Compliant; MF: TE Connectivity; MP: 6473427-1; PACKAGE: None; PRICE: None; PURCHASE-URL: https://pricing.snapeda.com/search/part/6473427-1/?ref=eda
J2 = VR10S05:VR10S05; COPYRIGHT: Copyright (C) 2022 Ultra Librarian. All rights reserved.; DIGI-KEY_PART_NUMBER_1: 1470-VR10S05-ND; MANUFACTURER_PART_NUMBER: VR10S05; MFR_NAME: XP Power
JP1 = SparkFun-Connectors:M04: Header 4 Standard 4-pin 0.1" header. Use with straight break away headers (SKU : PRT-00116), right angle break away headers (PRT-00553), swiss pins (PRT-00743), machine pins (PRT-00117), and female headers (PRT-00115). Molex polarized connector foot print use with SKU : PRT-08231 with associated crimp pins and housings. 1MM SMD Version SKU: PRT-10208
Q1 Q2 = SparkFun-DiscreteSemi:MOSFET-NCHANNEL: Generic NMOS footprint
R1-R71 = 1206res:R-US_
REC = SML-LX1206SIC-TR:SML-LX1206SIC-TR; COPYRIGHT: Copyright (C) 2021 Ultra Librarian. All rights reserved.; DIGI-KEY_PART_NUMBER_1: 67-1695-2-ND; DIGI-KEY_PART_NUMBER_2: 67-1695-1-ND; DIGI-KEY_PART_NUMBER_3: 67-1695-6-ND; DIGI-KEY_PART_NUMBER_4: 67-1695-2-NDL; MANUFACTURER_PART_NUMBER: SML-LX1206SIC-TR; MFR_NAME: Lumex
SW1 SW2 = CTS Electrocomponents - 204-211ST:CTS_ELECTROCOMPONENTS_204-211ST: SWITCH SLIDE DIP DPST 50MA 24V; AUTOMOTIVE: No; CENTROID_NOT_SPECIFIED: No; CONTACT_CURRENT_RATING: 50mA; CONTACT_RESISTANCE: 50mΩ; DATASHEET: https://www.ctscorp.com/wp-content/uploads/204.pdf; DEVICE_CLASS_L1: Electromechanical; DEVICE_CLASS_L2: Switches; DEVICE_CLASS_L3: DIP Switches; DIGIKEY_DESCRIPTION: SWITCH SLIDE DIP DPST 50MA 24V; DIGIKEY_PART_NUMBER: CT3103CT-ND; ELECTROMECHANICAL_LIFE: 5000Cycles; FOOTPRINT_VARIANT_NAME_0: Recommended_Land_Pattern; HEIGHT: 10.36mm; LEAD_FREE: Yes; MF: CTS Electrocomponents; MFG_PACKAGE_IDENT: 204-211; MFG_PACKAGE_IDENT_DATE: 0; MFG_PACKAGE_IDENT_REV: 0; MOUSER_DESCRIPTION: DIP Switches / SIP Switches DPST 1 position Epoxy Top Tape Seal; MOUSER_PART_NUMBER: 774-204-211STR; MPN: 204-211ST; NUMBER_OF_CIRCUITS: 1; PACKAGE: SMT_SWITCH_9MM78_7MM26; PREFIX: SW; ROHS: Yes; TEMPERATURE_RANGE_HIGH: +85°C; TEMPERATURE_RANGE_LOW: -55°C; THROW_CONFIGURATION: DPST; VERIFICATION_VERSION: 0.0.0.1; VOLTAGE_RATING_DC: 24V
U1 = XC6220B331MR-G:XC6220B331MR-G; COPYRIGHT: Copyright (C) 2022 Ultra Librarian. All rights reserved.; DIGI-KEY_PART_NUMBER_1: 893-1133-1-ND; DIGI-KEY_PART_NUMBER_2: 893-1133-2-ND; DIGI-KEY_PART_NUMBER_3: 893-1133-6-ND; MANUFACTURER_PART_NUMBER: XC6220B331MR-G; MFR_NAME: Torex Semiconductor
U4 = SparkFun-Boards:ARDUINO_R3_SHIELD: Shield form compatible with the Arduino Uno R3.
U6 U7 = ADS1119IPWT:ADS1119IPWT; COPYRIGHT: Copyright (C) 2021 Ultra Librarian. All rights reserved.; DIGI-KEY_PART_NUMBER_1: 296-50287-1-ND; DIGI-KEY_PART_NUMBER_2: 296-50287-2-ND; DIGI-KEY_PART_NUMBER_3: 296-50287-6-ND; MANUFACTURER_PART_NUMBER: ADS1119IPWT; MFR_NAME: Texas Instruments; REFDES: RefDes; TYPE: TYPE